# EAGLE schematic Sampling Detector (EAGLE 7.3.0)
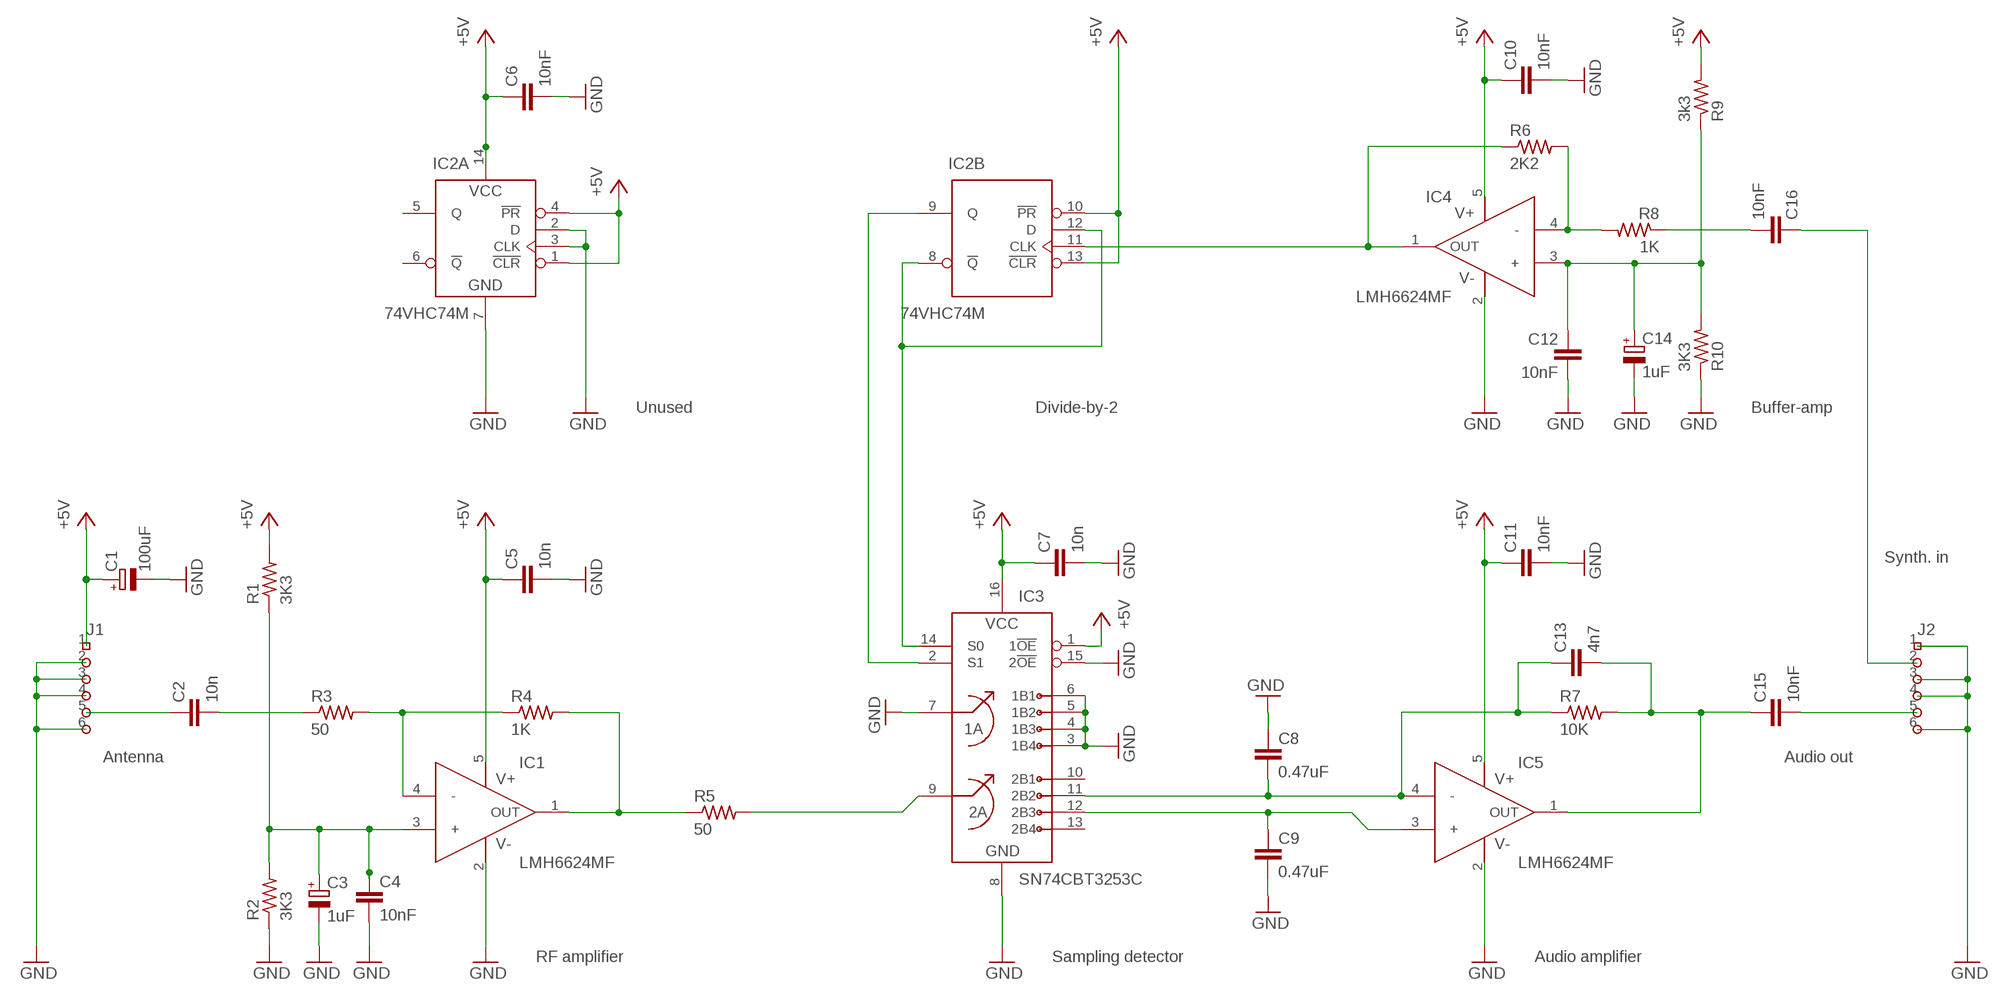
[diagram p0: schematic, sheet 1]

## Parts
C1  100uF  ELECTROLYTIC-PIGTAIL  [E5.8-8]
C2  10n  CAPACITOR-0805  [SMD-0805]
C3  1uF  ELECTROLYTIC-0805  [SMD-0805]
C4  10nF  CAPACITOR-0805  [SMD-0805]
C5  10n  CAPACITOR-0805  [SMD-0805]
C6  10nF  CAPACITOR-0805  [SMD-0805]
C7  10n  CAPACITOR-0805  [SMD-0805]
C8  0.47uF  CAPACITOR-0805  [SMD-0805]
C9  0.47uF  CAPACITOR-0805  [SMD-0805]
C10  10nF  CAPACITOR-0805  [SMD-0805]
C11  10nF  CAPACITOR-0805  [SMD-0805]
C12  10nF  CAPACITOR-0805  [SMD-0805]
C13  4n7  CAPACITOR-0805  [SMD-0805]
C14  1uF  ELECTROLYTIC-0805  [SMD-0805]
C15  10nF  CAPACITOR-0805  [SMD-0805]
C16  10nF  CAPACITOR-0805  [SMD-0805]
IC1  LMH6624MF  [SOT-23-DBV]
IC2  74VHC74M  [SOIC-14PIN]
IC3  SN74CBT3253C  [SOIC-16PIN]
IC4  LMH6624MF  [SOT-23-DBV]
IC5  LMH6624MF  [SOT-23-DBV]
J1  TERM-STRIP-6PIN  [TERM-STRIP-6PIN]
J2  TERM-STRIP-6PIN  [TERM-STRIP-6PIN]
R1  3K3  RESISTOR-0805  [SMD-0805]
R2  3K3  RESISTOR-0805  [SMD-0805]
R3  50  RESISTOR-0805  [SMD-0805]
R4  1K  RESISTOR-0805  [SMD-0805]
R5  50  RESISTOR-0805  [SMD-0805]
R6  2K2  RESISTOR-0805  [SMD-0805]
R7  10K  RESISTOR-0805  [SMD-0805]
R8  1K  RESISTOR-0805  [SMD-0805]
R9  3k3  RESISTOR-0805  [SMD-0805]
R10  3K3  RESISTOR-0805  [SMD-0805]

## Nets
+5V: C1.1(+) C5.1 C6.1 C7.1 C10.1 C11.1 IC1.5(V+) IC2.1(A:!CLR) IC2.4(A:!PR) IC2.10(B:!PR) IC2.13(B:!CLR) IC2.14(A:VCC) IC3.1(1!OE) IC3.16(VCC) IC4.5(V+) IC5.5(V+) J1.1 R1.2 R9.2
GND: C1.2(-) C3.2(-) C4.2 C5.2 C6.2 C7.2 C8.1 C9.2 C10.2 C11.2 C12.2 C14.2(-) IC1.2(V-) IC2.2(A:D) IC2.3(A:CLK) IC2.7(A:GND) IC3.3(1B4) IC3.4(1B3) IC3.5(1B2) IC3.6(1B1) IC3.7(1A) IC3.8(GND) IC3.15(2!OE) IC4.2(V-) IC5.2(V-) J1.2 J1.3 J1.4 J1.6 J2.1 J2.3 J2.4 J2.6 R2.1 R10.1
N$1: C9.1 IC3.12(2B3) IC5.3(+)
N$2: C13.2 C15.1 IC5.1(OUT) R7.2
N$3: IC1.4(-) R3.2 R4.1
N$4: IC3.9(2A) R5.2
N$5: C2.1 J1.5
N$6: IC1.1(OUT) R4.2 R5.1
N$7: C12.1 C14.1(+) IC4.3(+) R9.1 R10.2
N$8: C16.1 J2.2
N$9: IC4.4(-) R6.2 R8.2
N$10: IC2.11(B:CLK) IC4.1(OUT) R6.1
N$11: IC2.8(B:!Q) IC2.12(B:D) IC3.14(S0)
N$12: IC2.9(B:Q) IC3.2(S1)
N$13: C2.2 R3.1
N$14: C8.2 C13.1 IC3.11(2B2) IC5.4(-) R7.1
N$15: C15.2 J2.5
N$16: C16.2 R8.1
N$19: C3.1(+) C4.1 IC1.3(+) R1.1 R2.2
Unconnected: IC2.5(A:Q) IC2.6(A:!Q) IC3.10(2B1) IC3.13(2B4)

## Notes on the sheet
- Unused | Divide-by-2 | Buffer-amp
- Synth. in
- Antenna | Audio out
- RF amplifier | Sampling detector | Audio amplifier

## Library data of the parts
C1 = zl2avf:ELECTROLYTIC-PIGTAIL: Electrolytic (Pigtail) 0.2" pin spacing; 8mm diameter
C2 C4-C13 C15 C16 = zl2avf:CAPACITOR-0805: Capacitor 0805
C3 C14 = zl2avf:ELECTROLYTIC-0805: Electrolytic 0805 SMD
IC1 IC4 IC5 = zl2avf:LMH6624MF: LMH6624MF Low noise op-amp (1.5GHz bandwidth)
IC2 = zl2avf:74VHC74M: Dual SOIC D-type flip-flop (170MHz)
IC3 = zl2avf:SN74CBT3253C: SN74CBT3253C Mux/Demux Symbol shows multiplexer direction
J1 J2 = zl2avf:TERM-STRIP-6PIN: Terminal Strip: 6-pin
R1-R10 = zl2avf:RESISTOR-0805: Resistor 0805